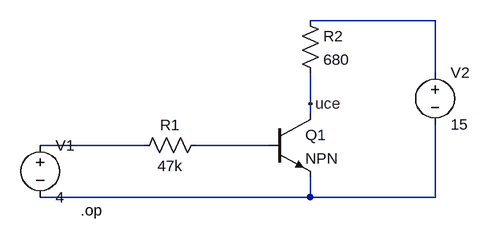
[diagram p0: schematic Parte1.asc]
Parte1.asc, the LTspice schematic file:
Version 4
SHEET 1 68488 105380
WIRE 68432 105072 68240 105072
WIRE 68432 105152 68432 105072
WIRE 68240 105200 68240 105152
WIRE 68240 105216 68240 105200
WIRE 67984 105264 67824 105264
WIRE 68176 105264 68064 105264
WIRE 68240 105344 68240 105312
WIRE 68240 105344 67824 105344
WIRE 68432 105344 68432 105232
WIRE 68432 105344 68240 105344
FLAG 68240 105200 uce
SYMBOL res 68080 105248 R90
WINDOW 0 0 56 VBottom 2
WINDOW 3 32 56 VTop 2
SYMATTR InstName R1
SYMATTR Value 47k
SYMBOL npn 68176 105216 R0
SYMATTR InstName Q1
SYMBOL res 68224 105056 R0
SYMATTR InstName R2
SYMATTR Value 680
SYMBOL voltage 67824 105248 R0
WINDOW 123 0 0 Left 0
WINDOW 39 0 0 Left 0
SYMATTR InstName V1
SYMATTR Value 4
SYMBOL voltage 68432 105136 R0
WINDOW 123 0 0 Left 0
WINDOW 39 0 0 Left 0
SYMATTR InstName V2
SYMATTR Value 15
TEXT 67886 105364 Left 2 !.op

The netlist it stands for:
* Parte1.asc
R1 N003 N002 47k
Q1 uce N003 N004 0 NPN
R2 N001 uce 680
V1 N002 N004 4
V2 N001 N004 15
.model NPN NPN
.model PNP PNP
.lib standard.bjt
.op
.backanno
.end